# Altium schematic sheet Main.SchDoc
size A2
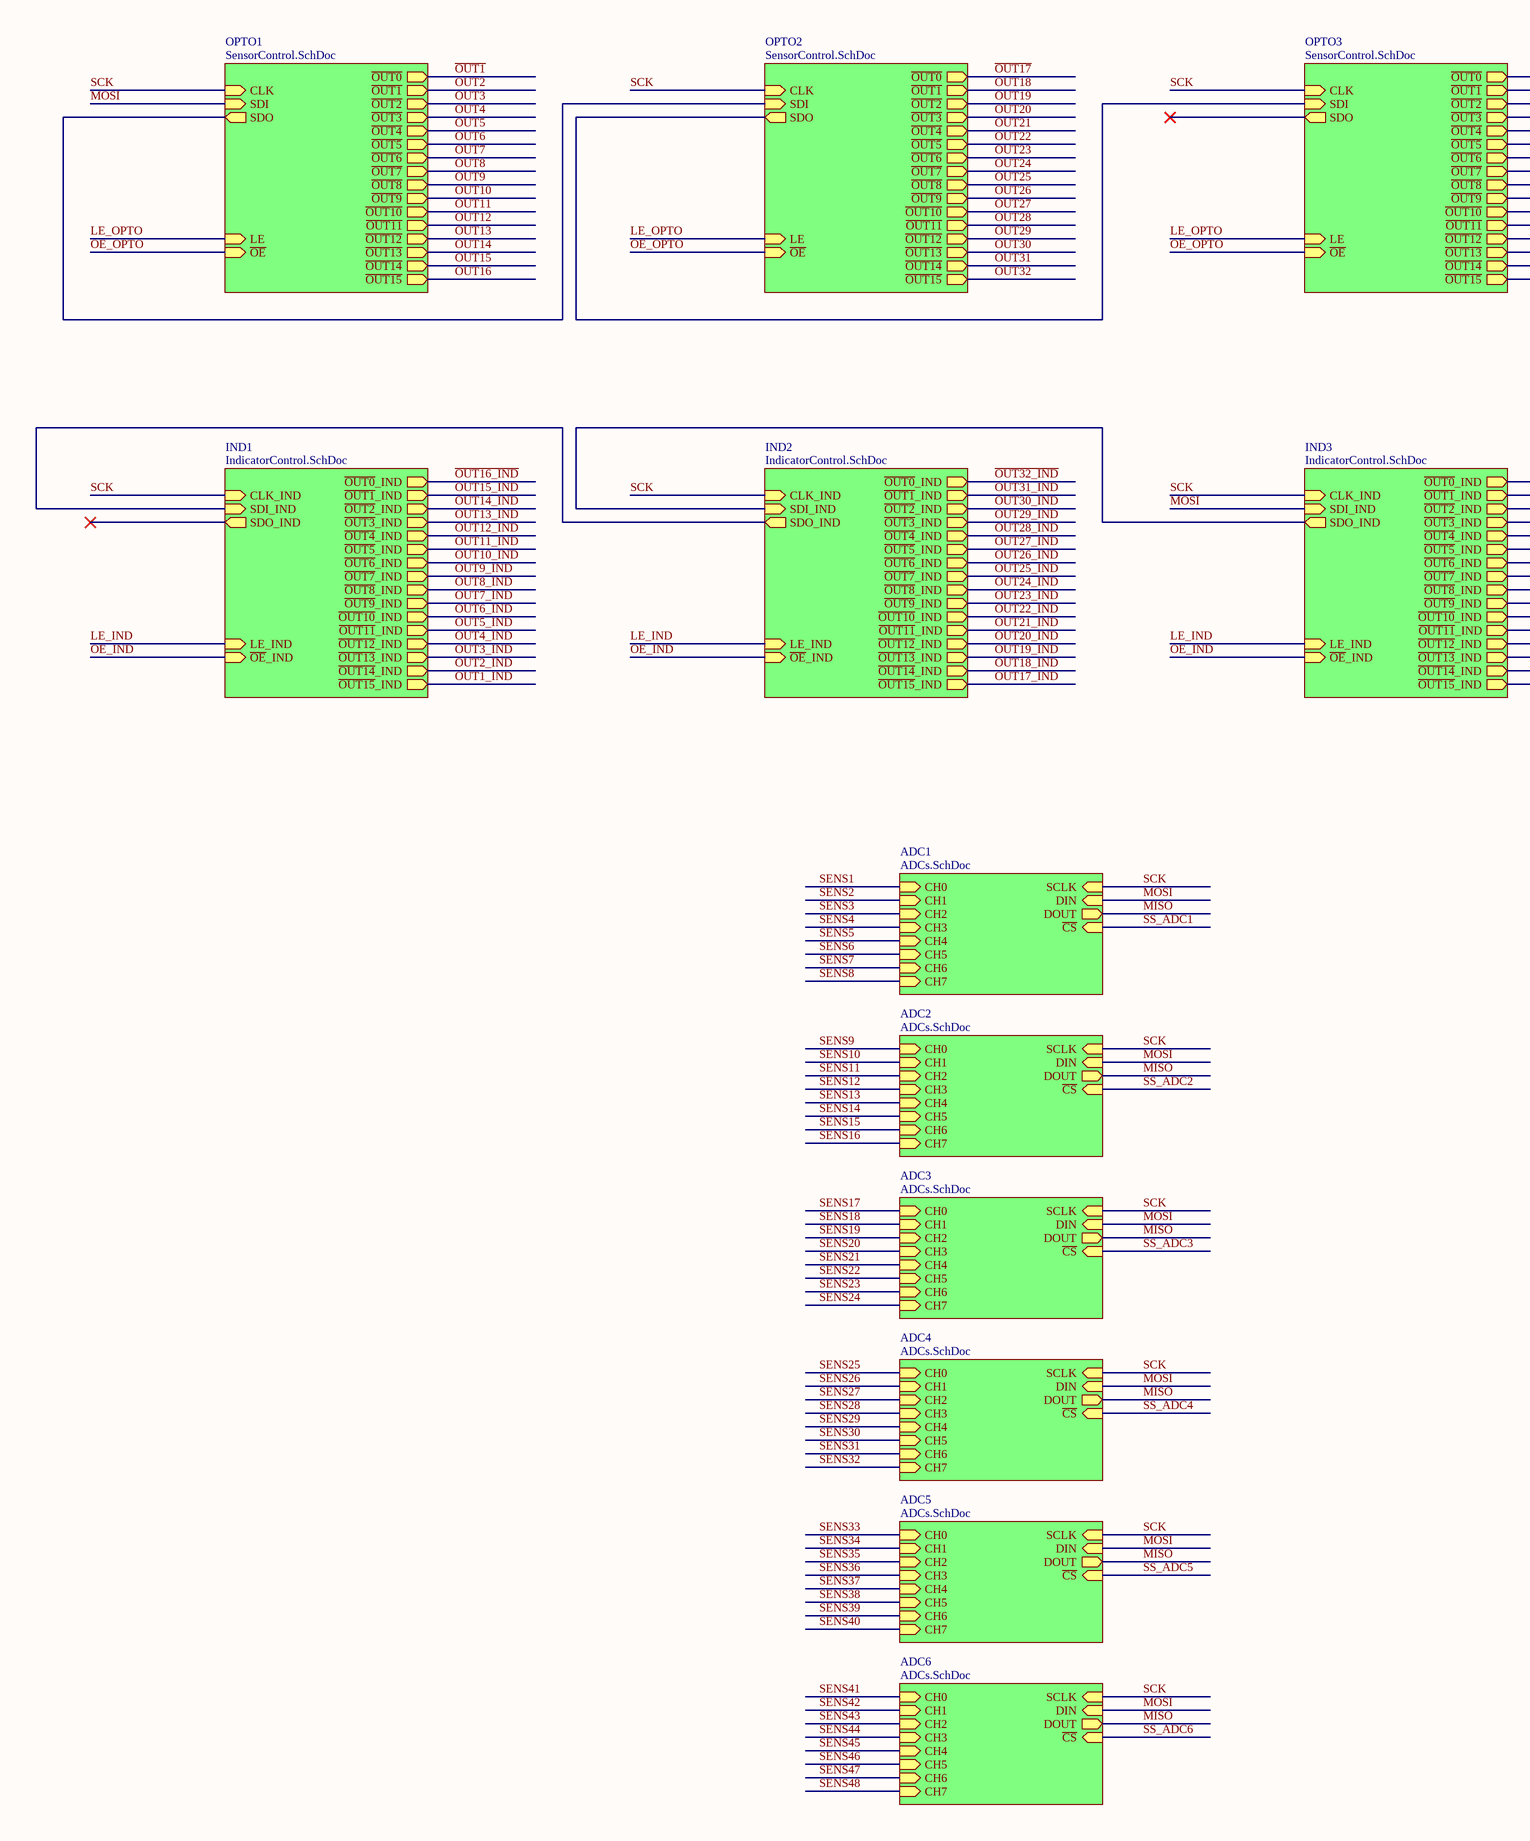
[diagram p0: Main.SchDoc, left]
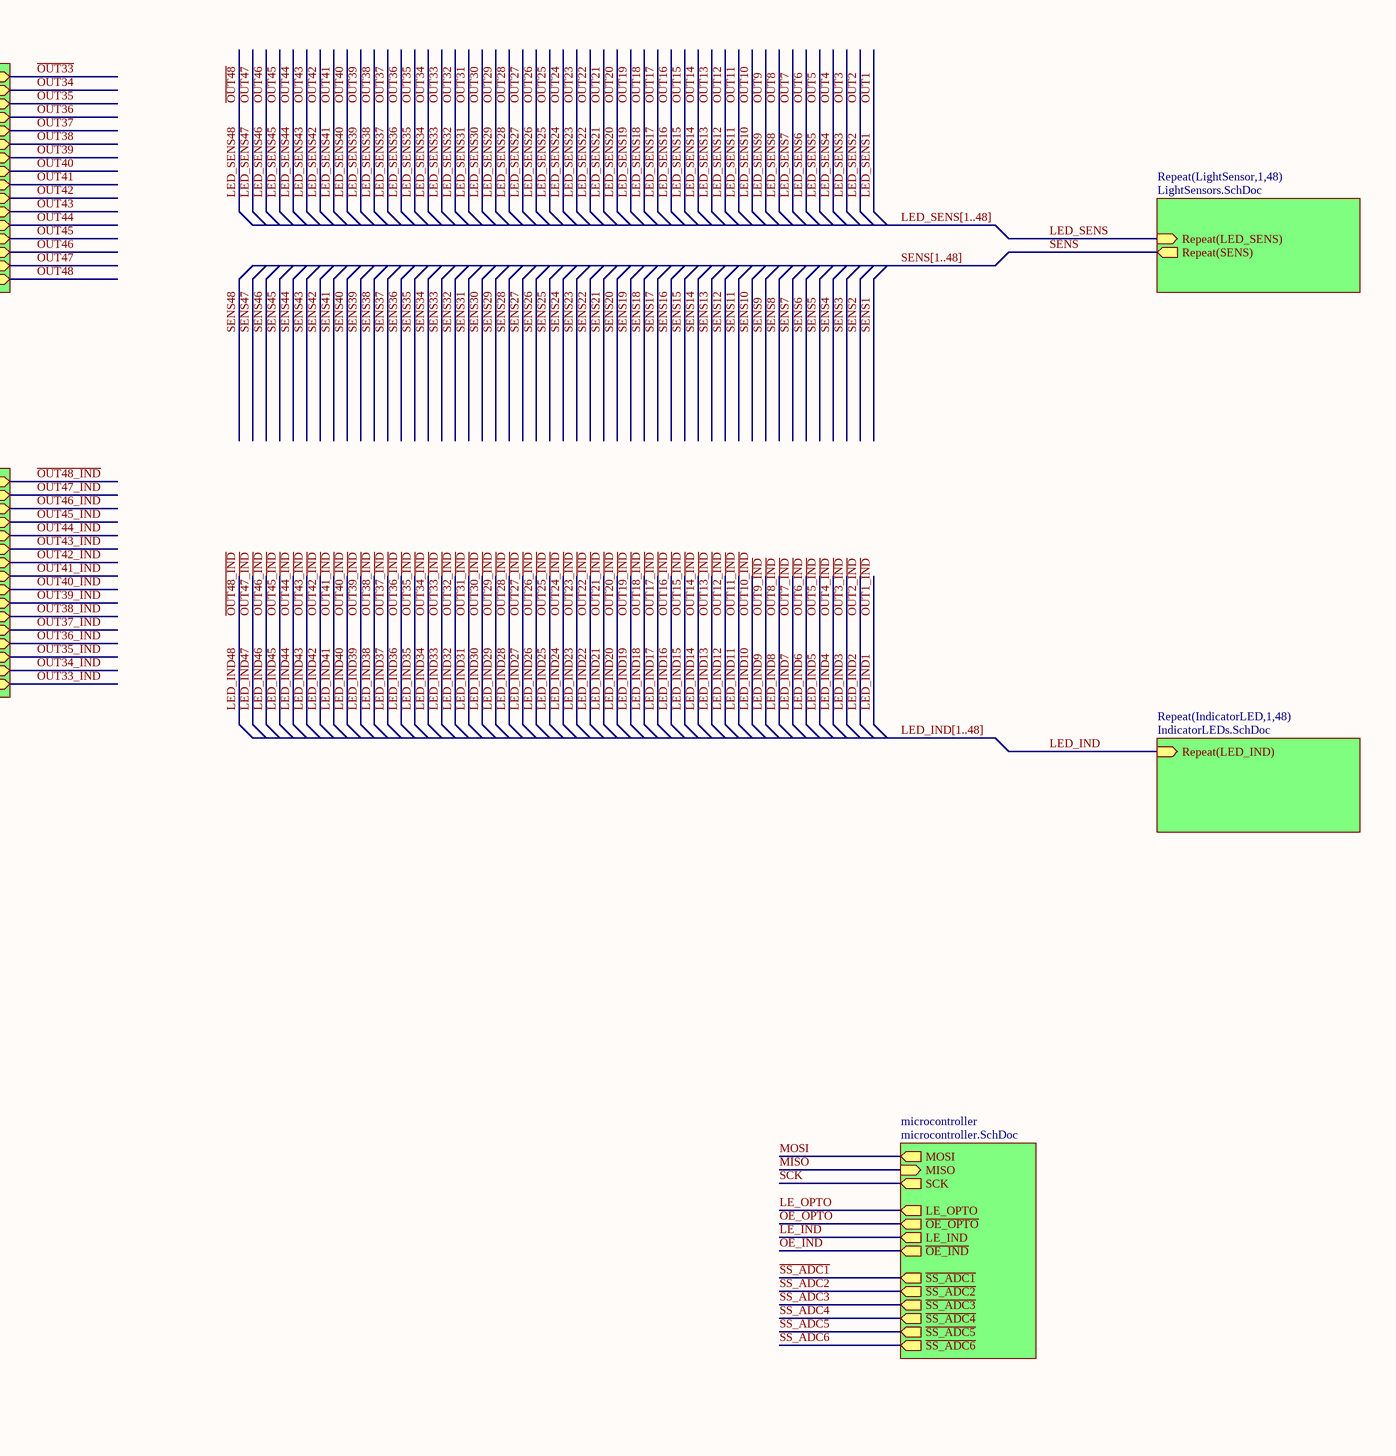
[diagram p1: Main.SchDoc, right]

## Sub-sheets
ADC1 = ADCs.SchDoc: CH0 (in), CH1 (in), CH2 (in), CH3 (in), CH4 (in), CH5 (in), CH6 (in), CH7 (in), SCLK (in), ~{CS} (in), DIN (in), DOUT (out)
ADC2 = ADCs.SchDoc: CH0 (in), CH1 (in), CH2 (in), CH3 (in), CH4 (in), CH5 (in), CH6 (in), CH7 (in), SCLK (in), ~{CS} (in), DIN (in), DOUT (out)
ADC3 = ADCs.SchDoc: CH0 (in), CH1 (in), CH2 (in), CH3 (in), CH4 (in), CH5 (in), CH6 (in), CH7 (in), SCLK (in), ~{CS} (in), DIN (in), DOUT (out)
ADC4 = ADCs.SchDoc: CH0 (in), CH1 (in), CH2 (in), CH3 (in), CH4 (in), CH5 (in), CH6 (in), CH7 (in), SCLK (in), ~{CS} (in), DIN (in), DOUT (out)
ADC5 = ADCs.SchDoc: CH0 (in), CH1 (in), CH2 (in), CH3 (in), CH4 (in), CH5 (in), CH6 (in), CH7 (in), SCLK (in), ~{CS} (in), DIN (in), DOUT (out)
ADC6 = ADCs.SchDoc: CH0 (in), CH1 (in), CH2 (in), CH3 (in), CH4 (in), CH5 (in), CH6 (in), CH7 (in), SCLK (in), ~{CS} (in), DIN (in), DOUT (out)
IND1 = IndicatorControl.SchDoc: ~{OUT0}_IND (out), ~{OUT1}_IND (out), ~{OUT2}_IND (out), ~{OUT3}_IND (out), ~{OUT4}_IND (out), ~{OUT5}_IND (out), ~{OUT6}_IND (out), ~{OUT7}_IND (out), ~{OUT8}_IND (out), ~{OUT9}_IND (out), ~{OUT10}_IND (out), ~{OUT11}_IND (out), ~{OUT12}_IND (out), ~{OUT13}_IND (out), ~{OUT14}_IND (out), ~{OUT15}_IND (out), SDI_IND (in), ~{OE}_IND (in), CLK_IND (in), LE_IND (in), SDO_IND (out)
IND2 = IndicatorControl.SchDoc: ~{OUT0}_IND (out), ~{OUT1}_IND (out), ~{OUT2}_IND (out), ~{OUT3}_IND (out), ~{OUT4}_IND (out), ~{OUT5}_IND (out), ~{OUT6}_IND (out), ~{OUT7}_IND (out), ~{OUT8}_IND (out), ~{OUT9}_IND (out), ~{OUT10}_IND (out), ~{OUT11}_IND (out), ~{OUT12}_IND (out), ~{OUT13}_IND (out), ~{OUT14}_IND (out), ~{OUT15}_IND (out), SDI_IND (in), ~{OE}_IND (in), CLK_IND (in), LE_IND (in), SDO_IND (out)
IND3 = IndicatorControl.SchDoc: ~{OUT0}_IND (out), ~{OUT1}_IND (out), ~{OUT2}_IND (out), ~{OUT3}_IND (out), ~{OUT4}_IND (out), ~{OUT5}_IND (out), ~{OUT6}_IND (out), ~{OUT7}_IND (out), ~{OUT8}_IND (out), ~{OUT9}_IND (out), ~{OUT10}_IND (out), ~{OUT11}_IND (out), ~{OUT12}_IND (out), ~{OUT13}_IND (out), ~{OUT14}_IND (out), ~{OUT15}_IND (out), SDI_IND (in), ~{OE}_IND (in), CLK_IND (in), LE_IND (in), SDO_IND (out)
microcontroller = microcontroller.SchDoc: LE_IND (out), ~{OE_IND} (out), ~{SS_ADC4} (out), LE_OPTO (out), ~{SS_ADC3} (out), MOSI (out), SCK (out), ~{OE_OPTO} (out), ~{SS_ADC1} (out), ~{SS_ADC2} (out), MISO (in), ~{SS_ADC5} (out), ~{SS_ADC6} (out)
OPTO1 = SensorControl.SchDoc: ~{OUT0} (out), ~{OUT1} (out), ~{OUT2} (out), ~{OUT3} (out), ~{OUT4} (out), ~{OUT5} (out), ~{OUT6} (out), ~{OUT7} (out), ~{OUT8} (out), ~{OUT9} (out), ~{OUT10} (out), ~{OUT11} (out), ~{OUT12} (out), ~{OUT13} (out), ~{OUT14} (out), ~{OUT15} (out), SDI (in), ~{OE} (in), CLK (in), LE (in), SDO (out)
OPTO2 = SensorControl.SchDoc: ~{OUT0} (out), ~{OUT1} (out), ~{OUT2} (out), ~{OUT3} (out), ~{OUT4} (out), ~{OUT5} (out), ~{OUT6} (out), ~{OUT7} (out), ~{OUT8} (out), ~{OUT9} (out), ~{OUT10} (out), ~{OUT11} (out), ~{OUT12} (out), ~{OUT13} (out), ~{OUT14} (out), ~{OUT15} (out), SDI (in), ~{OE} (in), CLK (in), LE (in), SDO (out)
OPTO3 = SensorControl.SchDoc: ~{OUT0} (out), ~{OUT1} (out), ~{OUT2} (out), ~{OUT3} (out), ~{OUT4} (out), ~{OUT5} (out), ~{OUT6} (out), ~{OUT7} (out), ~{OUT8} (out), ~{OUT9} (out), ~{OUT10} (out), ~{OUT11} (out), ~{OUT12} (out), ~{OUT13} (out), ~{OUT14} (out), ~{OUT15} (out), SDI (in), ~{OE} (in), CLK (in), LE (in), SDO (out)
Repeat(IndicatorLED,1,48) = IndicatorLEDs.SchDoc: Repeat(LED_IND) (in)
Repeat(LightSensor,1,48) = LightSensors.SchDoc: Repeat(SENS) (out), Repeat(LED_SENS) (in)

## Nets
LE_IND: sheet IND1/LE_IND, sheet IND2/LE_IND, sheet microcontroller/LE_IND, sheet IND3/LE_IND
LE_OPTO: sheet OPTO1/LE, sheet OPTO2/LE, sheet microcontroller/LE_OPTO, sheet OPTO3/LE
LED_IND: sheet Repeat(IndicatorLED,1,48)/Repeat(LED_IND)
LED_IND1: sheet IND1/~{OUT15}_IND  [also labelled ~{OUT1_IND}]
LED_IND2: sheet IND1/~{OUT14}_IND  [also labelled ~{OUT2_IND}]
LED_IND3: sheet IND1/~{OUT13}_IND  [also labelled ~{OUT3_IND}]
LED_IND4: sheet IND1/~{OUT12}_IND  [also labelled ~{OUT4_IND}]
LED_IND5: sheet IND1/~{OUT11}_IND  [also labelled ~{OUT5_IND}]
LED_IND6: sheet IND1/~{OUT10}_IND  [also labelled ~{OUT6_IND}]
LED_IND7: sheet IND1/~{OUT9}_IND  [also labelled ~{OUT7_IND}]
LED_IND8: sheet IND1/~{OUT8}_IND  [also labelled ~{OUT8_IND}]
LED_IND9: sheet IND1/~{OUT7}_IND  [also labelled ~{OUT9_IND}]
LED_IND10: sheet IND1/~{OUT6}_IND  [also labelled ~{OUT10_IND}]
LED_IND11: sheet IND1/~{OUT5}_IND  [also labelled ~{OUT11_IND}]
LED_IND12: sheet IND1/~{OUT4}_IND  [also labelled ~{OUT12_IND}]
LED_IND13: sheet IND1/~{OUT3}_IND  [also labelled ~{OUT13_IND}]
LED_IND14: sheet IND1/~{OUT2}_IND  [also labelled ~{OUT14_IND}]
LED_IND15: sheet IND1/~{OUT1}_IND  [also labelled ~{OUT15_IND}]
LED_IND16: sheet IND1/~{OUT0}_IND  [also labelled ~{OUT16_IND}]
LED_IND17: sheet IND2/~{OUT15}_IND  [also labelled ~{OUT17_IND}]
LED_IND18: sheet IND2/~{OUT14}_IND  [also labelled ~{OUT18_IND}]
LED_IND19: sheet IND2/~{OUT13}_IND  [also labelled ~{OUT19_IND}]
LED_IND20: sheet IND2/~{OUT12}_IND  [also labelled ~{OUT20_IND}]
LED_IND21: sheet IND2/~{OUT11}_IND  [also labelled ~{OUT21_IND}]
LED_IND22: sheet IND2/~{OUT10}_IND  [also labelled ~{OUT22_IND}]
LED_IND23: sheet IND2/~{OUT9}_IND  [also labelled ~{OUT23_IND}]
LED_IND24: sheet IND2/~{OUT8}_IND  [also labelled ~{OUT24_IND}]
LED_IND25: sheet IND2/~{OUT7}_IND  [also labelled ~{OUT25_IND}]
LED_IND26: sheet IND2/~{OUT6}_IND  [also labelled ~{OUT26_IND}]
LED_IND27: sheet IND2/~{OUT5}_IND  [also labelled ~{OUT27_IND}]
LED_IND28: sheet IND2/~{OUT4}_IND  [also labelled ~{OUT28_IND}]
LED_IND29: sheet IND2/~{OUT3}_IND  [also labelled ~{OUT29_IND}]
LED_IND30: sheet IND2/~{OUT2}_IND  [also labelled ~{OUT30_IND}]
LED_IND31: sheet IND2/~{OUT1}_IND  [also labelled ~{OUT31_IND}]
LED_IND32: sheet IND2/~{OUT0}_IND  [also labelled ~{OUT32_IND}]
LED_IND33: sheet IND3/~{OUT15}_IND  [also labelled ~{OUT33_IND}]
LED_IND34: sheet IND3/~{OUT14}_IND  [also labelled ~{OUT34_IND}]
LED_IND35: sheet IND3/~{OUT13}_IND  [also labelled ~{OUT35_IND}]
LED_IND36: sheet IND3/~{OUT12}_IND  [also labelled ~{OUT36_IND}]
LED_IND37: sheet IND3/~{OUT11}_IND  [also labelled ~{OUT37_IND}]
LED_IND38: sheet IND3/~{OUT10}_IND  [also labelled ~{OUT38_IND}]
LED_IND39: sheet IND3/~{OUT9}_IND  [also labelled ~{OUT39_IND}]
LED_IND40: sheet IND3/~{OUT8}_IND  [also labelled ~{OUT40_IND}]
LED_IND41: sheet IND3/~{OUT7}_IND  [also labelled ~{OUT41_IND}]
LED_IND42: sheet IND3/~{OUT6}_IND  [also labelled ~{OUT42_IND}]
LED_IND43: sheet IND3/~{OUT5}_IND  [also labelled ~{OUT43_IND}]
LED_IND44: sheet IND3/~{OUT4}_IND  [also labelled ~{OUT44_IND}]
LED_IND45: sheet IND3/~{OUT3}_IND  [also labelled ~{OUT45_IND}]
LED_IND46: sheet IND3/~{OUT2}_IND  [also labelled ~{OUT46_IND}]
LED_IND47: sheet IND3/~{OUT1}_IND  [also labelled ~{OUT47_IND}]
LED_IND48: sheet IND3/~{OUT0}_IND  [also labelled ~{OUT48_IND}]
LED_SENS: sheet Repeat(LightSensor,1,48)/Repeat(LED_SENS)
LED_SENS1: sheet OPTO1/~{OUT0}  [also labelled ~{OUT1}]
LED_SENS2: sheet OPTO1/~{OUT1}  [also labelled ~{OUT2}]
LED_SENS3: sheet OPTO1/~{OUT2}  [also labelled ~{OUT3}]
LED_SENS4: sheet OPTO1/~{OUT3}  [also labelled ~{OUT4}]
LED_SENS5: sheet OPTO1/~{OUT4}  [also labelled ~{OUT5}]
LED_SENS6: sheet OPTO1/~{OUT5}  [also labelled ~{OUT6}]
LED_SENS7: sheet OPTO1/~{OUT6}  [also labelled ~{OUT7}]
LED_SENS8: sheet OPTO1/~{OUT7}  [also labelled ~{OUT8}]
LED_SENS9: sheet OPTO1/~{OUT8}  [also labelled ~{OUT9}]
LED_SENS10: sheet OPTO1/~{OUT9}  [also labelled ~{OUT10}]
LED_SENS11: sheet OPTO1/~{OUT10}  [also labelled ~{OUT11}]
LED_SENS12: sheet OPTO1/~{OUT11}  [also labelled ~{OUT12}]
LED_SENS13: sheet OPTO1/~{OUT12}  [also labelled ~{OUT13}]
LED_SENS14: sheet OPTO1/~{OUT13}  [also labelled ~{OUT14}]
LED_SENS15: sheet OPTO1/~{OUT14}  [also labelled ~{OUT15}]
LED_SENS16: sheet OPTO1/~{OUT15}  [also labelled ~{OUT16}]
LED_SENS17: sheet OPTO2/~{OUT0}  [also labelled ~{OUT17}]
LED_SENS18: sheet OPTO2/~{OUT1}  [also labelled ~{OUT18}]
LED_SENS19: sheet OPTO2/~{OUT2}  [also labelled ~{OUT19}]
LED_SENS20: sheet OPTO2/~{OUT3}  [also labelled ~{OUT20}]
LED_SENS21: sheet OPTO2/~{OUT4}  [also labelled ~{OUT21}]
LED_SENS22: sheet OPTO2/~{OUT5}  [also labelled ~{OUT22}]
LED_SENS23: sheet OPTO2/~{OUT6}  [also labelled ~{OUT23}]
LED_SENS24: sheet OPTO2/~{OUT7}  [also labelled ~{OUT24}]
LED_SENS25: sheet OPTO2/~{OUT8}  [also labelled ~{OUT25}]
LED_SENS26: sheet OPTO2/~{OUT9}  [also labelled ~{OUT26}]
LED_SENS27: sheet OPTO2/~{OUT10}  [also labelled ~{OUT27}]
LED_SENS28: sheet OPTO2/~{OUT11}  [also labelled ~{OUT28}]
LED_SENS29: sheet OPTO2/~{OUT12}  [also labelled ~{OUT29}]
LED_SENS30: sheet OPTO2/~{OUT13}  [also labelled ~{OUT30}]
LED_SENS31: sheet OPTO2/~{OUT14}  [also labelled ~{OUT31}]
LED_SENS32: sheet OPTO2/~{OUT15}  [also labelled ~{OUT32}]
LED_SENS33: sheet OPTO3/~{OUT0}  [also labelled ~{OUT33}]
LED_SENS34: sheet OPTO3/~{OUT1}  [also labelled ~{OUT34}]
LED_SENS35: sheet OPTO3/~{OUT2}  [also labelled ~{OUT35}]
LED_SENS36: sheet OPTO3/~{OUT3}  [also labelled ~{OUT36}]
LED_SENS37: sheet OPTO3/~{OUT4}  [also labelled ~{OUT37}]
LED_SENS38: sheet OPTO3/~{OUT5}  [also labelled ~{OUT38}]
LED_SENS39: sheet OPTO3/~{OUT6}  [also labelled ~{OUT39}]
LED_SENS40: sheet OPTO3/~{OUT7}  [also labelled ~{OUT40}]
LED_SENS41: sheet OPTO3/~{OUT8}  [also labelled ~{OUT41}]
LED_SENS42: sheet OPTO3/~{OUT9}  [also labelled ~{OUT42}]
LED_SENS43: sheet OPTO3/~{OUT10}  [also labelled ~{OUT43}]
LED_SENS44: sheet OPTO3/~{OUT11}  [also labelled ~{OUT44}]
LED_SENS45: sheet OPTO3/~{OUT12}  [also labelled ~{OUT45}]
LED_SENS46: sheet OPTO3/~{OUT13}  [also labelled ~{OUT46}]
LED_SENS47: sheet OPTO3/~{OUT14}  [also labelled ~{OUT47}]
LED_SENS48: sheet OPTO3/~{OUT15}  [also labelled ~{OUT48}]
MISO: sheet microcontroller/MISO, sheet ADC1/DOUT, sheet ADC2/DOUT, sheet ADC3/DOUT, sheet ADC4/DOUT, sheet ADC5/DOUT, sheet ADC6/DOUT
MOSI: sheet OPTO1/SDI, sheet microcontroller/MOSI, sheet ADC1/DIN, sheet ADC2/DIN, sheet ADC3/DIN, sheet ADC4/DIN, sheet IND3/SDI_IND, sheet ADC5/DIN, sheet ADC6/DIN
~{OE_IND}: sheet IND1/~{OE}_IND, sheet IND2/~{OE}_IND, sheet microcontroller/~{OE_IND}, sheet IND3/~{OE}_IND
~{OE_OPTO}: sheet OPTO1/~{OE}, sheet OPTO2/~{OE}, sheet microcontroller/~{OE_OPTO}, sheet OPTO3/~{OE}
~{SS_ADC1}: sheet microcontroller/~{SS_ADC1}, sheet ADC1/~{CS}
~{SS_ADC2}: sheet microcontroller/~{SS_ADC2}, sheet ADC2/~{CS}
~{SS_ADC3}: sheet microcontroller/~{SS_ADC3}, sheet ADC3/~{CS}
~{SS_ADC4}: sheet microcontroller/~{SS_ADC4}, sheet ADC4/~{CS}
~{SS_ADC5}: sheet microcontroller/~{SS_ADC5}, sheet ADC5/~{CS}
~{SS_ADC6}: sheet microcontroller/~{SS_ADC6}, sheet ADC6/~{CS}
SCK: sheet OPTO1/CLK, sheet OPTO2/CLK, sheet IND1/CLK_IND, sheet IND2/CLK_IND, sheet microcontroller/SCK, sheet ADC1/SCLK, sheet ADC2/SCLK, sheet ADC3/SCLK, sheet ADC4/SCLK, sheet OPTO3/CLK, sheet IND3/CLK_IND, sheet ADC5/SCLK, sheet ADC6/SCLK
SENS: sheet Repeat(LightSensor,1,48)/Repeat(SENS)
SENS1: sheet ADC1/CH0
SENS2: sheet ADC1/CH1
SENS3: sheet ADC1/CH2
SENS4: sheet ADC1/CH3
SENS5: sheet ADC1/CH4
SENS6: sheet ADC1/CH5
SENS7: sheet ADC1/CH6
SENS8: sheet ADC1/CH7
SENS9: sheet ADC2/CH0
SENS10: sheet ADC2/CH1
SENS11: sheet ADC2/CH2
SENS12: sheet ADC2/CH3
SENS13: sheet ADC2/CH4
SENS14: sheet ADC2/CH5
SENS15: sheet ADC2/CH6
SENS16: sheet ADC2/CH7
SENS17: sheet ADC3/CH0
SENS18: sheet ADC3/CH1
SENS19: sheet ADC3/CH2
SENS20: sheet ADC3/CH3
SENS21: sheet ADC3/CH4
SENS22: sheet ADC3/CH5
SENS23: sheet ADC3/CH6
SENS24: sheet ADC3/CH7
SENS25: sheet ADC4/CH0
SENS26: sheet ADC4/CH1
SENS27: sheet ADC4/CH2
SENS28: sheet ADC4/CH3
SENS29: sheet ADC4/CH4
SENS30: sheet ADC4/CH5
SENS31: sheet ADC4/CH6
SENS32: sheet ADC4/CH7
SENS33: sheet ADC5/CH0
SENS34: sheet ADC5/CH1
SENS35: sheet ADC5/CH2
SENS36: sheet ADC5/CH3
SENS37: sheet ADC5/CH4
SENS38: sheet ADC5/CH5
SENS39: sheet ADC5/CH6
SENS40: sheet ADC5/CH7
SENS41: sheet ADC6/CH0
SENS42: sheet ADC6/CH1
SENS43: sheet ADC6/CH2
SENS44: sheet ADC6/CH3
SENS45: sheet ADC6/CH4
SENS46: sheet ADC6/CH5
SENS47: sheet ADC6/CH6
SENS48: sheet ADC6/CH7
(unnamed): sheet OPTO1/SDO, sheet OPTO2/SDI
(unnamed): sheet OPTO2/SDO, sheet OPTO3/SDI
(unnamed): sheet IND1/SDI_IND, sheet IND2/SDO_IND
(unnamed): sheet IND2/SDI_IND, sheet IND3/SDO_IND

## Buses and harness runs
bus LED_IND[1..48]
bus LED_SENS[1..48]
bus SENS[1..48]